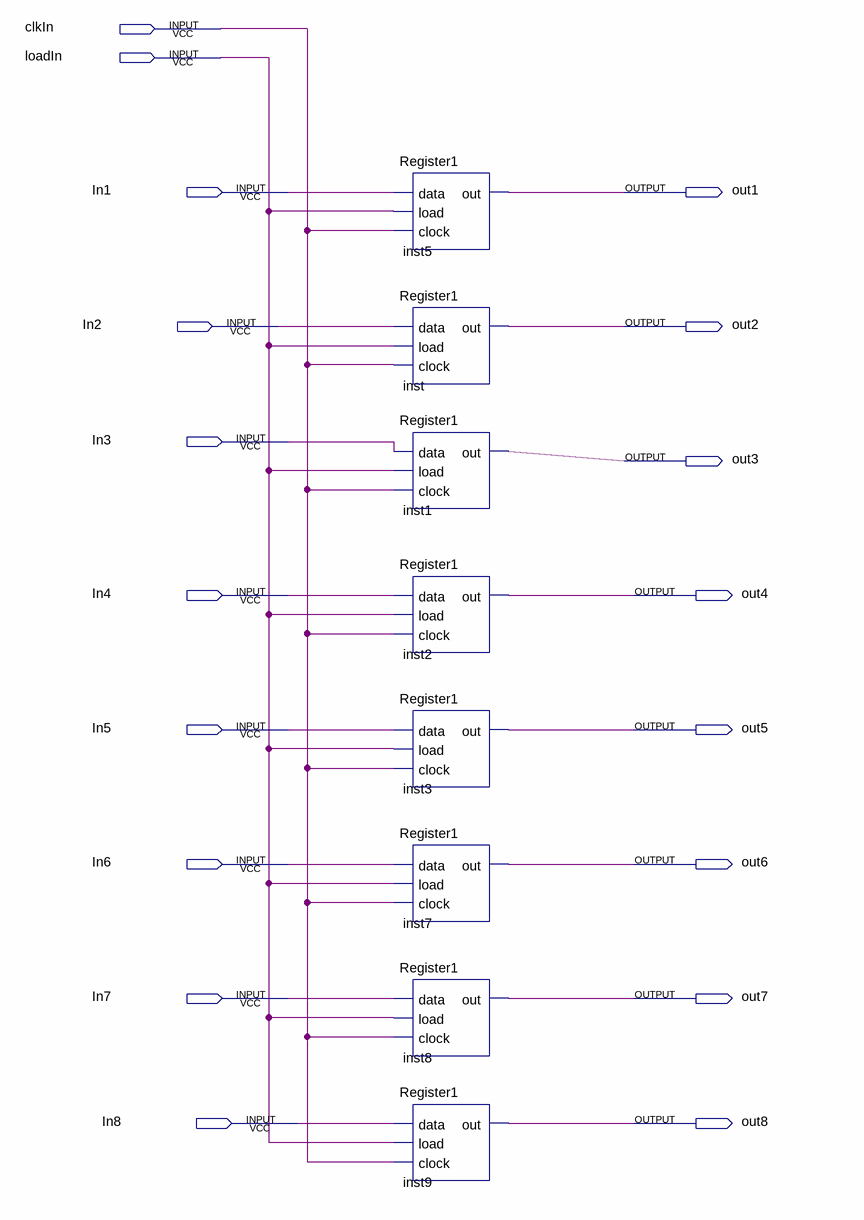
[diagram p0: schematic sheet]
// Quartus schematic Register8.bdf as structural Verilog: 8 symbols, 18 pins
module Register8 (
  input  clkIn,
  input  loadIn,
  input  In1,
  input  In2,
  input  In3,
  input  In4,
  input  In5,
  input  In6,
  input  In7,
  input  In8,
  output out1,
  output out2,
  output out3,
  output out4,
  output out5,
  output out6,
  output out7,
  output out8
);

  Register1 inst5 (.data(In1), .load(loadIn), .clock(clkIn), .out(out1));
  Register1 inst (.data(In2), .load(loadIn), .clock(clkIn), .out(out2));
  Register1 inst1 (.data(In3), .load(loadIn), .clock(clkIn), .out(out3));
  Register1 inst2 (.data(In4), .load(loadIn), .clock(clkIn), .out(out4));
  Register1 inst3 (.data(In5), .load(loadIn), .clock(clkIn), .out(out5));
  Register1 inst7 (.data(In6), .load(loadIn), .clock(clkIn), .out(out6));
  Register1 inst8 (.data(In7), .load(loadIn), .clock(clkIn), .out(out7));
  Register1 inst9 (.data(In8), .load(loadIn), .clock(clkIn), .out(out8));
endmodule
